# EasyEDA schematic 6502v2.json
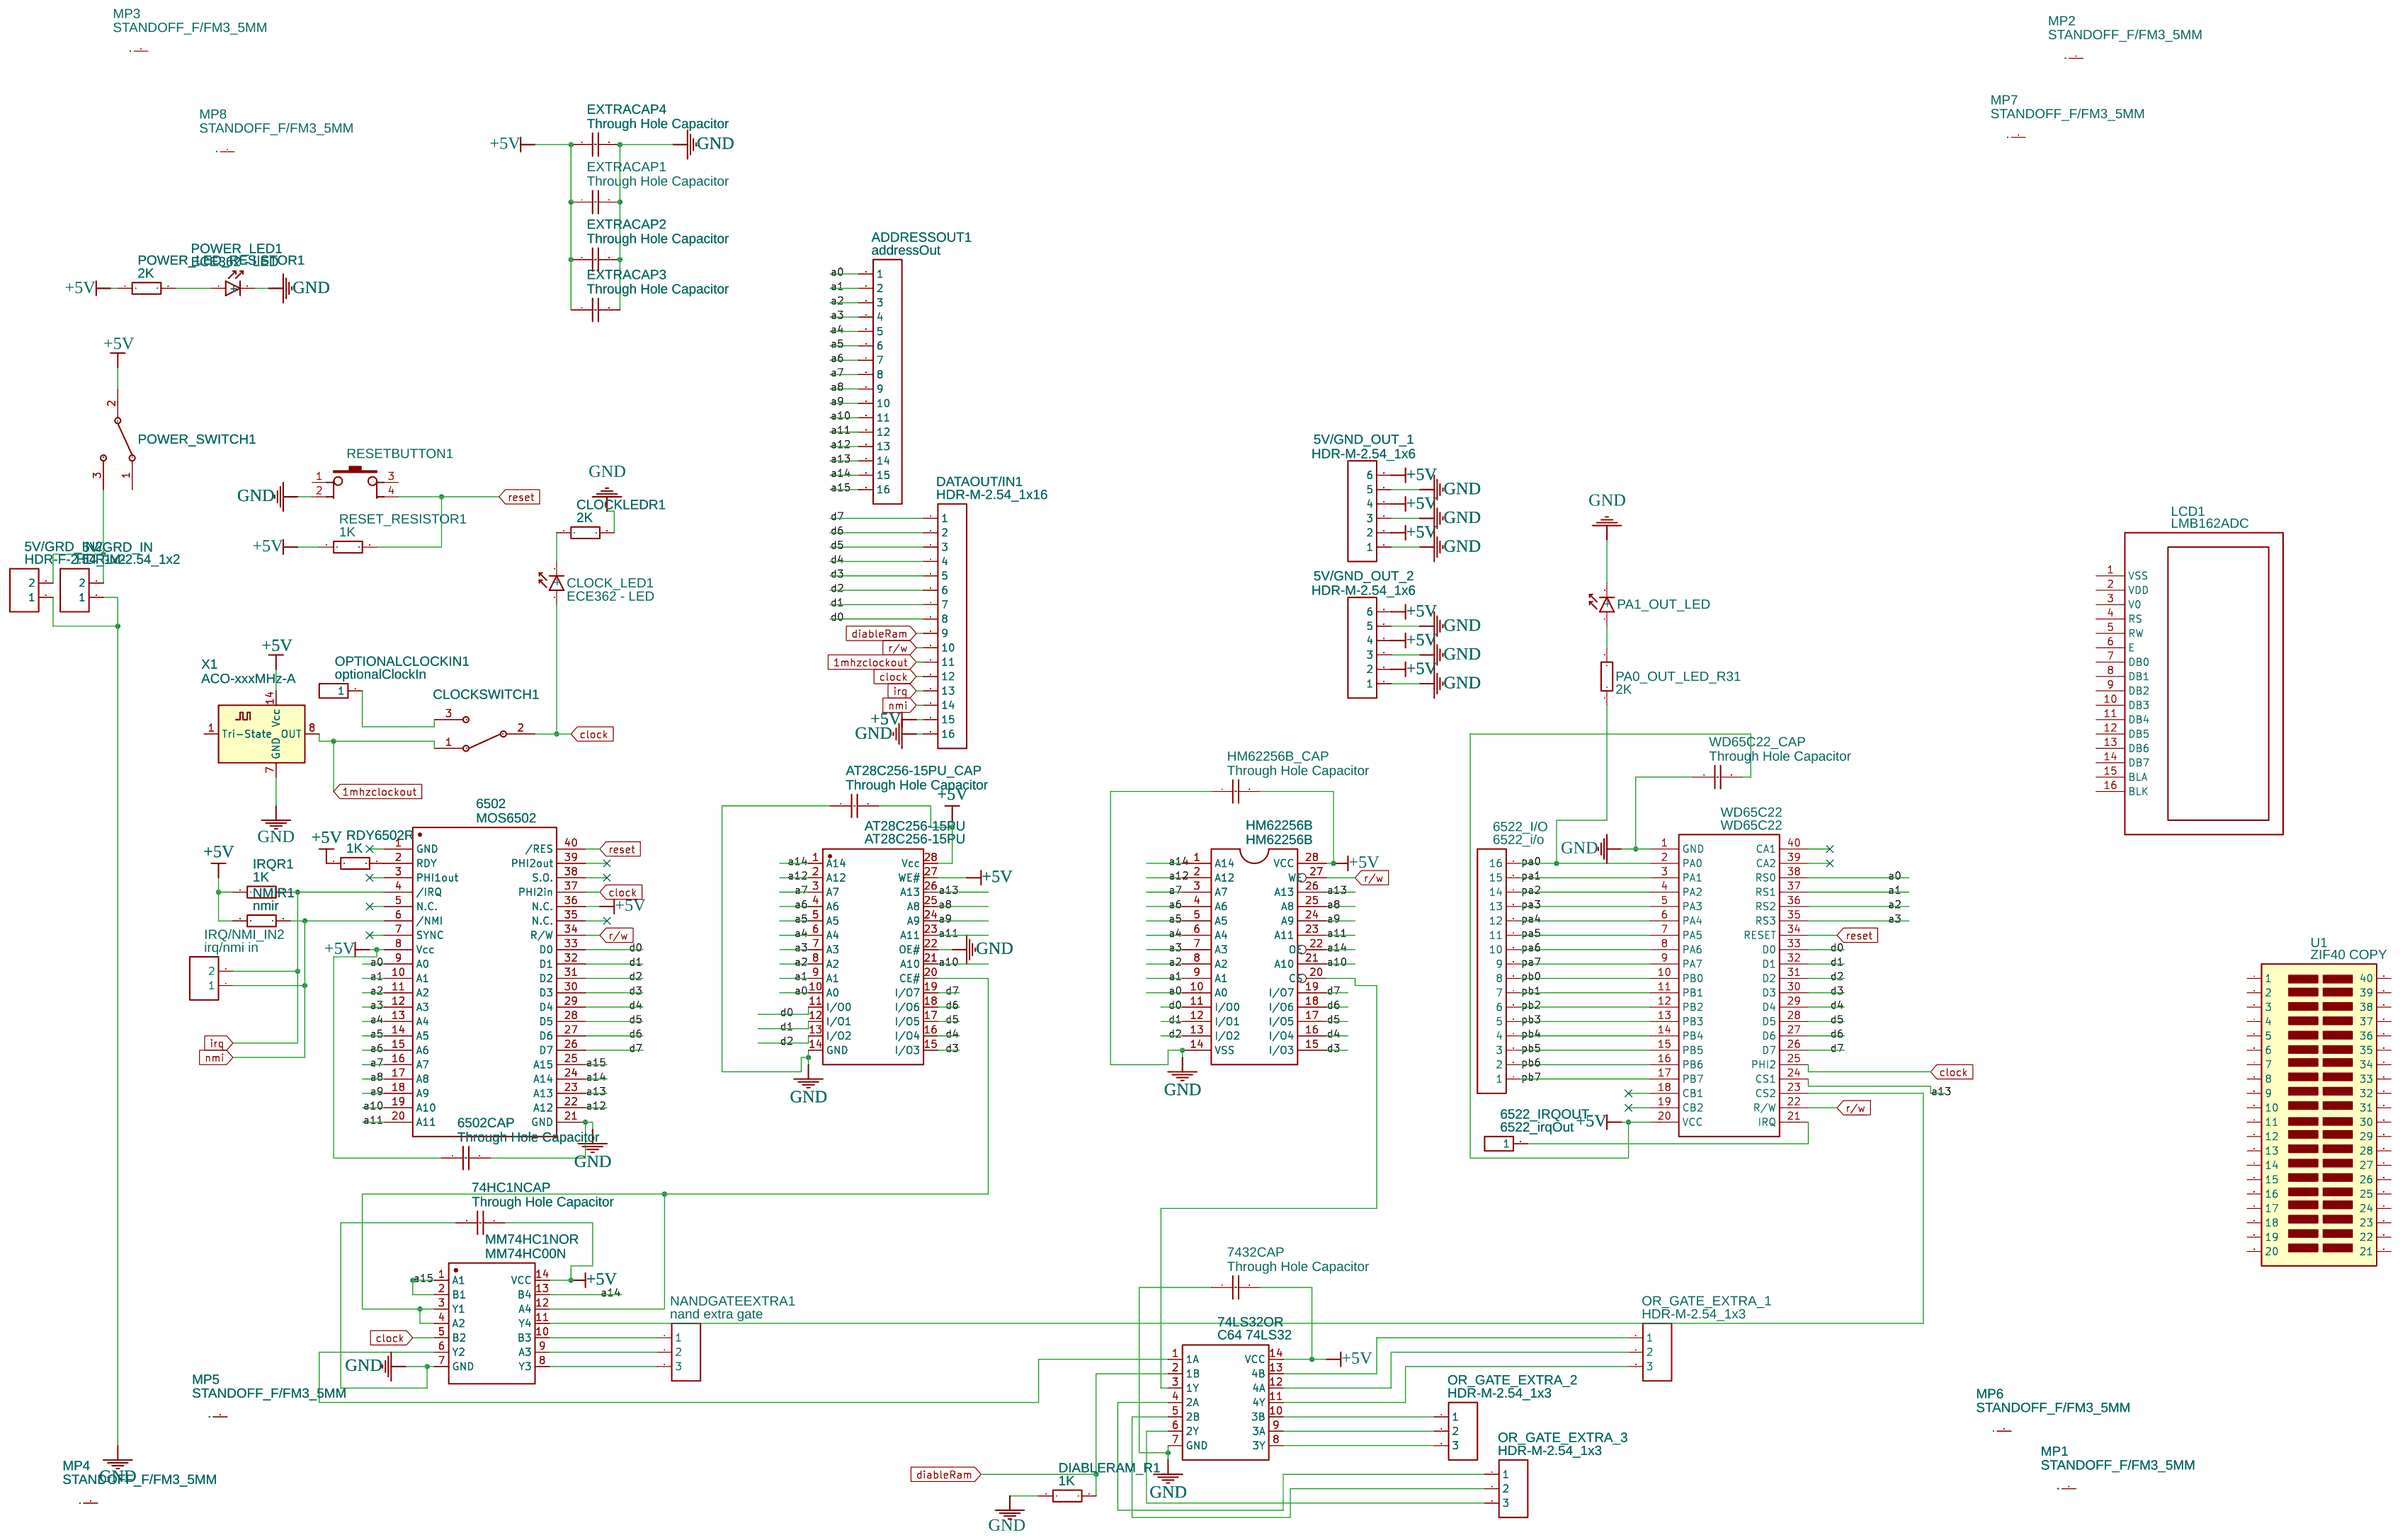
[diagram p0: schematic sheet]

## Parts
5V/GND_OUT_1  HDR-M-2.54_1x6  [HDR-M-2.54_1X6]
5V/GND_OUT_2  HDR-M-2.54_1x6  [HDR-M-2.54_1X6]
5V/GRD_IN  HDR-M-2.54_1x2  [HDR-M-2.54_1X2]
5V/GRD_IN2  HDR-F-2.54_1x2  [HDR-F-2.54_1X2]
74HC1NCAP  Through Hole Capacitor  [THROUGH HOLE TANTALUM CAPACITOR]
74LS32OR  C64 74LS32  [C64 74LS32]
6502  MOS6502  [DIP40]
6502CAP  Through Hole Capacitor  [THROUGH HOLE TANTALUM CAPACITOR]
6522_I/O  6522_i/o  [HDR-M-2.54_1X16]
6522_IRQOUT  6522_irqOut  [HDR-M-2.54_1X1]
7432CAP  Through Hole Capacitor  [THROUGH HOLE TANTALUM CAPACITOR]
ADDRESSOUT1  addressOut  [HDR-M-2.54_1X16]
AT28C256-15PU  AT28C256-15PU  [PDIP-28_L37.0-W13.5-P2.54-LS15.6-BL]
AT28C256-15PU_CAP  Through Hole Capacitor  [THROUGH HOLE TANTALUM CAPACITOR]
CLOCK_LED1  ECE362 - LED  [LED-3MM-2.54MM-THROUGH HOLE-FIXED]
CLOCKLEDR1  2K  [GENERIC THROUGH-HOLE RESISTOR]
CLOCKSWITCH1  Slide Switches_SPDT(Single Pole Double Throw)  [SW-TH_SS-12D01-GX]
DATAOUT/IN1  HDR-M-2.54_1x16  [HDR-M-2.54_1X16]
DIABLERAM_R1  1K  [GENERIC THROUGH-HOLE RESISTOR]
EXTRACAP1  Through Hole Capacitor  [THROUGH HOLE TANTALUM CAPACITOR]
EXTRACAP2  Through Hole Capacitor  [THROUGH HOLE TANTALUM CAPACITOR]
EXTRACAP3  Through Hole Capacitor  [THROUGH HOLE TANTALUM CAPACITOR]
EXTRACAP4  Through Hole Capacitor  [THROUGH HOLE TANTALUM CAPACITOR]
HM62256B  HM62256B  [DIL-28]
HM62256B_CAP  Through Hole Capacitor  [THROUGH HOLE TANTALUM CAPACITOR]
IRQ/NMI_IN2  irq/nmi in  [HDR-F-2.54_1X2]
IRQR1  1K  [GENERIC THROUGH-HOLE RESISTOR]
LCD1  LMB162ADC  [LCD1602]
MM74HC1NOR  MM74HC00N  [DIP14]
MP1  STANDOFF_F/FM3_5MM  [STANDOFF_HEX_FEMALE_550X500_M3X0.5_MTGP850H320]
MP2  STANDOFF_F/FM3_5MM  [STANDOFF_HEX_FEMALE_550X500_M3X0.5_MTGP850H320]
MP3  STANDOFF_F/FM3_5MM  [STANDOFF_HEX_FEMALE_550X500_M3X0.5_MTGP850H320]
MP4  STANDOFF_F/FM3_5MM  [STANDOFF_HEX_FEMALE_550X500_M3X0.5_MTGP850H320]
MP5  STANDOFF_F/FM3_5MM  [STANDOFF_HEX_FEMALE_550X500_M3X0.5_MTGP850H320]
MP6  STANDOFF_F/FM3_5MM  [STANDOFF_HEX_FEMALE_550X500_M3X0.5_MTGP850H320]
MP7  STANDOFF_F/FM3_5MM  [STANDOFF_HEX_FEMALE_550X500_M3X0.5_MTGP850H320]
MP8  STANDOFF_F/FM3_5MM  [STANDOFF_HEX_FEMALE_550X500_M3X0.5_MTGP850H320]
NANDGATEEXTRA1  nand extra gate  [HDR-M-2.54_1X3]
NMIR1  nmir  [GENERIC THROUGH-HOLE RESISTOR]
OPTIONALCLOCKIN1  optionalClockIn  [HDR-M-2.54_1X1]
OR_GATE_EXTRA_1  HDR-M-2.54_1x3  [HDR-M-2.54_1X3]
OR_GATE_EXTRA_2  HDR-M-2.54_1x3  [HDR-M-2.54_1X3]
OR_GATE_EXTRA_3  HDR-M-2.54_1x3  [HDR-M-2.54_1X3]
PA0_OUT_LED_R31  2K  [GENERIC THROUGH-HOLE RESISTOR]
PA1_OUT_LED  ECE362 - LED  [LED-3MM-2.54MM-THROUGH HOLE-FIXED]
POWER_LED1  ECE362 - LED  [LED-3MM-2.54MM-THROUGH HOLE-FIXED]
POWER_LED_RESISTOR1  2K  [GENERIC THROUGH-HOLE RESISTOR]
POWER_SWITCH1  Slide Switches_SPDT(Single Pole Double Throw)  [SW-TH_SS-12D01-GX]
RDY6502R  1K  [GENERIC THROUGH-HOLE RESISTOR]
RESET_RESISTOR1  1K  [GENERIC THROUGH-HOLE RESISTOR]
RESETBUTTON1  PUSHBUTTON 4PIN (4.5MM*6.1MM) COPY  [PUSHBUTTON 4PIN (4.5MM*6.1MM)]
U1  ZIF40 COPY  [40 PIN ZIF SOCKET]
WD65C22  WD65C22  [DIP-40_L52.0-W13.7-P2.54-LS15.2-BL]
WD65C22_CAP  Through Hole Capacitor  [THROUGH HOLE TANTALUM CAPACITOR]
X1  ACO-xxxMHz-A  [OSCILLATOR_DIP-14]

## Library data of the parts
5V/GND_OUT_1 5V/GND_OUT_2 = HDR-M-2.54_1x6: Supplier Part: C190819; Supplier: LCSC; Contributor: LCEDA_Lib
5V/GRD_IN = HDR-M-2.54_1x2: Supplier Part: C124375; Supplier: LCSC; Contributor: LCEDA_Lib
5V/GRD_IN2 IRQ/NMI_IN2 = HDR-F-2.54_1x2: Supplier Part: C49661; Supplier: LCSC; Contributor: LCEDA_Lib
74HC1NCAP 6502CAP 7432CAP AT28C256-15PU_CAP EXTRACAP1-EXTRACAP4 HM62256B_CAP WD65C22_CAP = Through Hole Capacitor: Manufacturer Part: TAP106K016SCS; Contributor: Felix_95; link: https://www.digikey.ca/scripts/DkSearch/dksus.dll?Detail&itemSeq=258076471&uq=636594837846473767
74LS32OR = C64 74LS32: Contributor: TomPilot
6502 = MOS6502: Contributor: LukasJele
6522_I/O ADDRESSOUT1 DATAOUT/IN1 = HDR-M-2.54_1x16: Supplier: LCSC; Contributor: LCEDA_Lib
6522_IRQOUT OPTIONALCLOCKIN1 = HDR-M-2.54_1x1: Supplier Part: C81276; Supplier: LCSC; Contributor: LCEDA_Lib
AT28C256-15PU = AT28C256-15PU: Supplier: LCSC; Supplier Part: C1348752; Manufacturer: MICROCHIP(美国微芯); Contributor: LCSC; JLCPCB Part Class: Extended Part
CLOCK_LED1 PA1_OUT_LED POWER_LED1 = ECE362 - LED: Supplier: Mouser; Contributor: victorbramhall
CLOCKLEDR1 DIABLERAM_R1 IRQR1 NMIR1 PA0_OUT_LED_R31 POWER_LED_RESISTOR1 RDY6502R RESET_RESISTOR1 = GENERIC THROUGH HOLE RESISTOR 2: Supplier: LCSC; Supplier Part: C348946; Manufacturer: ResistorToday; Manufacturer Part: EWWR0006J10K0T9; Contributor: sanketwalopkar; JLCPCB Part Class: Extended Part; Resistance: 10kΩ
CLOCKSWITCH1 POWER_SWITCH1 = Slide Switches_SPDT(Single Pole Double Throw): Contributor: banjerdmaising3
HM62256B = HM62256B: Manufacturer: Hitachi; Contributor: andrewkawalec164
LCD1 = LMB162ADC: Supplier: LCSC; Manufacturer: TOPWAY; Supplier Part: C9741
MM74HC1NOR = MM74HC00N
MP1-MP8 = STANDOFF_F/FM3_5MM
NANDGATEEXTRA1 OR_GATE_EXTRA_1-OR_GATE_EXTRA_3 = HDR-M-2.54_1x3: Supplier Part: C180248; Supplier: LCSC; Contributor: LCEDA_Lib
RESETBUTTON1 = PUSHBUTTON 4PIN (4.5MM*6.1MM) COPY: Contributor: Sazzad Akhanda
U1 = ZIF40 COPY: Manufacturer Part: New SchematicLib; Contributor: PedroM
WD65C22 = WD65C22: Contributor: 21schemerhornn
X1 = ACO-xxxMHz-A: Contributor: KiCAD; license: https://www.gnu.org/licenses/lgpl-2.1.html

## Nets
+5V: 5V/GND_OUT_1.2 5V/GND_OUT_1.4 5V/GND_OUT_1.6 5V/GND_OUT_2.2 5V/GND_OUT_2.4 5V/GND_OUT_2.6 74HC1NCAP.2 74LS32OR.14(VCC) 6502.8(Vcc) 6502.36(N.C.) 6502CAP.1 7432CAP.2 AT28C256-15PU.27(WE#) AT28C256-15PU.28(Vcc) AT28C256-15PU_CAP.2 DATAOUT/IN1.15 EXTRACAP1.1 EXTRACAP2.1 EXTRACAP3.1 EXTRACAP4.1 HM62256B.28(VCC) HM62256B_CAP.2 IRQR1.1 MM74HC1NOR.14(VCC) NMIR1.1 POWER_LED_RESISTOR1.1 POWER_SWITCH1.2 RDY6502R.1 RESET_RESISTOR1.1 WD65C22.20(VCC) WD65C22_CAP.2 X1.14(Vcc)
GND: 5V/GND_OUT_1.1 5V/GND_OUT_1.3 5V/GND_OUT_1.5 5V/GND_OUT_2.1 5V/GND_OUT_2.3 5V/GND_OUT_2.5 5V/GRD_IN.1 5V/GRD_IN2.1 74HC1NCAP.1 74LS32OR.7(GND) 6502.21(GND) 6502CAP.2 7432CAP.1 AT28C256-15PU.14(GND) AT28C256-15PU.22(OE#) AT28C256-15PU_CAP.1 CLOCKLEDR1.2 DATAOUT/IN1.16 DIABLERAM_R1.1 EXTRACAP1.2 EXTRACAP2.2 EXTRACAP3.2 EXTRACAP4.2 HM62256B.14(VSS) HM62256B_CAP.1 MM74HC1NOR.7(GND) PA1_OUT_LED.2(-) POWER_LED1.2(-) RESETBUTTON1.2 WD65C22.1(GND) WD65C22_CAP.1 X1.7(GND)
1mhzclockout: CLOCKSWITCH1.1 DATAOUT/IN1.11 X1.8(OUT)
a0: 6502.9(A0) ADDRESSOUT1.1 AT28C256-15PU.10(A0) HM62256B.10(A0) WD65C22.38(RS0)
a1: 6502.10(A1) ADDRESSOUT1.2 AT28C256-15PU.9(A1) HM62256B.9(A1) WD65C22.37(RS1)
a2: 6502.11(A2) ADDRESSOUT1.3 AT28C256-15PU.8(A2) HM62256B.8(A2) WD65C22.36(RS2)
a3: 6502.12(A3) ADDRESSOUT1.4 AT28C256-15PU.7(A3) HM62256B.7(A3) WD65C22.35(RS3)
a4: 6502.13(A4) ADDRESSOUT1.5 AT28C256-15PU.6(A4) HM62256B.6(A4)
a5: 6502.14(A5) ADDRESSOUT1.6 AT28C256-15PU.5(A5) HM62256B.5(A5)
a6: 6502.15(A6) ADDRESSOUT1.7 AT28C256-15PU.4(A6) HM62256B.4(A6)
a7: 6502.16(A7) ADDRESSOUT1.8 AT28C256-15PU.3(A7) HM62256B.3(A7)
a8: 6502.17(A8) ADDRESSOUT1.9 AT28C256-15PU.25(A8) HM62256B.25(A8)
a9: 6502.18(A9) ADDRESSOUT1.10 AT28C256-15PU.24(A9) HM62256B.24(A9)
a10: 6502.19(A10) ADDRESSOUT1.11 AT28C256-15PU.21(A10) HM62256B.21(A10)
a11: 6502.20(A11) ADDRESSOUT1.12 AT28C256-15PU.23(A11) HM62256B.23(A11)
a12: 6502.22(A12) ADDRESSOUT1.13 AT28C256-15PU.2(A12) HM62256B.2(A12)
a13: 6502.23(A13) ADDRESSOUT1.14 AT28C256-15PU.26(A13) HM62256B.26(A13) WD65C22.24(CS1)
a14: 6502.24(A14) ADDRESSOUT1.15 AT28C256-15PU.1(A14) HM62256B.1(A14) HM62256B.22(OE) MM74HC1NOR.13(B4)
a15: 6502.25(A15) ADDRESSOUT1.16 MM74HC1NOR.1(A1) MM74HC1NOR.2(B1)
clock: 6502.37(PHI2in) CLOCK_LED1.1(+) CLOCKSWITCH1.2 DATAOUT/IN1.12 MM74HC1NOR.5(B2) WD65C22.25(PHI2)
d0: 6502.33(D0) AT28C256-15PU.11(I/O0) DATAOUT/IN1.8 HM62256B.11(I/O0) WD65C22.33(D0)
d1: 6502.32(D1) AT28C256-15PU.12(I/O1) DATAOUT/IN1.7 HM62256B.12(I/O1) WD65C22.32(D1)
d2: 6502.31(D2) AT28C256-15PU.13(I/O2) DATAOUT/IN1.6 HM62256B.13(I/O2) WD65C22.31(D2)
d3: 6502.30(D3) AT28C256-15PU.15(I/O3) DATAOUT/IN1.5 HM62256B.15(I/O3) WD65C22.30(D3)
d4: 6502.29(D4) AT28C256-15PU.16(I/O4) DATAOUT/IN1.4 HM62256B.16(I/O4) WD65C22.29(D4)
d5: 6502.28(D5) AT28C256-15PU.17(I/O5) DATAOUT/IN1.3 HM62256B.17(I/O5) WD65C22.28(D5)
d6: 6502.27(D6) AT28C256-15PU.18(I/O6) DATAOUT/IN1.2 HM62256B.18(I/O6) WD65C22.27(D6)
d7: 6502.26(D7) AT28C256-15PU.19(I/O7) DATAOUT/IN1.1 HM62256B.19(I/O7) WD65C22.26(D7)
diableRam: 74LS32OR.2(1B) DATAOUT/IN1.9 DIABLERAM_R1.2
irq: 6502.4(/IRQ) DATAOUT/IN1.13 IRQ/NMI_IN2.2 IRQR1.2
nmi: 6502.6(/NMI) DATAOUT/IN1.14 IRQ/NMI_IN2.1 NMIR1.2
pa0: 6522_I/O.16 PA0_OUT_LED_R31.1 WD65C22.2(PA0)
pa1: 6522_I/O.15 WD65C22.3(PA1)
pa2: 6522_I/O.14 WD65C22.4(PA2)
pa3: 6522_I/O.13 WD65C22.5(PA3)
pa4: 6522_I/O.12 WD65C22.6(PA4)
pa5: 6522_I/O.11 WD65C22.7(PA5)
pa6: 6522_I/O.10 WD65C22.8(PA6)
pa7: 6522_I/O.9 WD65C22.9(PA7)
pb0: 6522_I/O.8 WD65C22.10(PB0)
pb1: 6522_I/O.7 WD65C22.11(PB1)
pb2: 6522_I/O.6 WD65C22.12(PB2)
pb3: 6522_I/O.5 WD65C22.13(PB3)
pb4: 6522_I/O.4 WD65C22.14(PB4)
pb5: 6522_I/O.3 WD65C22.15(PB5)
pb6: 6522_I/O.2 WD65C22.16(PB6)
pb7: 6522_I/O.1 WD65C22.17(PB7)
r/w: 6502.34(R/W) DATAOUT/IN1.10 HM62256B.27(WE) WD65C22.22(R/W)
reset: 6502.40(/RES) RESET_RESISTOR1.2 RESETBUTTON1.4 WD65C22.34(RESET)
Net-(5V/GRD_IN-2): 5V/GRD_IN.2 5V/GRD_IN2.2 POWER_SWITCH1.3
Net-(74LS32OR-1): 74LS32OR.1(1A) MM74HC1NOR.6(Y2)
Net-(74LS32OR-3): 74LS32OR.3(1Y) HM62256B.20(CS)
Net-(74LS32OR-4): 74LS32OR.4(2A) OR_GATE_EXTRA_3.1
Net-(74LS32OR-5): 74LS32OR.5(2B) OR_GATE_EXTRA_3.2
Net-(74LS32OR-6): 74LS32OR.6(2Y) OR_GATE_EXTRA_3.3
Net-(74LS32OR-8): 74LS32OR.8(3Y) OR_GATE_EXTRA_2.3
Net-(74LS32OR-9): 74LS32OR.9(3A) OR_GATE_EXTRA_2.2
Net-(74LS32OR-10): 74LS32OR.10(3B) OR_GATE_EXTRA_2.1
Net-(74LS32OR-11): 74LS32OR.11(4Y) OR_GATE_EXTRA_1.3
Net-(74LS32OR-12): 74LS32OR.12(4A) OR_GATE_EXTRA_1.2
Net-(74LS32OR-13): 74LS32OR.13(4B) OR_GATE_EXTRA_1.1
Net-(6502-2): 6502.2(RDY) RDY6502R.2
Net-(6522_IRQOUT-1): 6522_IRQOUT.1 WD65C22.21(IRQ)
Net-(AT28C256-15PU-20): AT28C256-15PU.20(CE#) MM74HC1NOR.3(Y1) MM74HC1NOR.4(A2) MM74HC1NOR.12(A4)
Net-(CLOCK_LED1-2): CLOCK_LED1.2(-) CLOCKLEDR1.1
Net-(CLOCKSWITCH1-3): CLOCKSWITCH1.3 OPTIONALCLOCKIN1.1
Net-(MM74HC1NOR-8): MM74HC1NOR.8(Y3) NANDGATEEXTRA1.3
Net-(MM74HC1NOR-9): MM74HC1NOR.9(A3) NANDGATEEXTRA1.2
Net-(MM74HC1NOR-10): MM74HC1NOR.10(B3) NANDGATEEXTRA1.1
Net-(MM74HC1NOR-11): MM74HC1NOR.11(Y4) WD65C22.23(CS2)
Net-(PA0_OUT_LED_R31-2): PA0_OUT_LED_R31.2 PA1_OUT_LED.1(+)
Net-(POWER_LED1-1): POWER_LED1.1(+) POWER_LED_RESISTOR1.2

Not connected (* = marked no-connect by the designer): 6502 1(GND) 3(PHI1out) 5(N.C.) 7(SYNC) 35(N.C.) 38(S.O.) 39(PHI2out); LCD1 1(VSS) 2(VDD) 3(V0) 4(RS) 5(RW) 6(E) 7(DB0) 8(DB1) 9(DB2) 10(DB3) 11(DB4) 12(DB5) 13(DB6) 14(DB7) 15(BLA) 16(BLK); MP1 1(P$1); MP2 1(P$1); MP3 1(P$1); MP4 1(P$1); MP5 1(P$1); MP6 1(P$1); MP7 1(P$1); MP8 1(P$1); POWER_SWITCH1 1; RESETBUTTON1 1 3; U1 1 2 3 4 5 6 7 8 9 10 11 12 13 14 15 16 17 18 19 20 21 22 23 24 25 26 27 28 29 30 31 32 33 34 35 36 37 38 39 40; WD65C22 18(CB1) 19(CB2) 39(CA2) 40(CA1); X1 1(Tri-State)
